# Altium project Farm_Pump.PrjPcb (part 1 of 2)
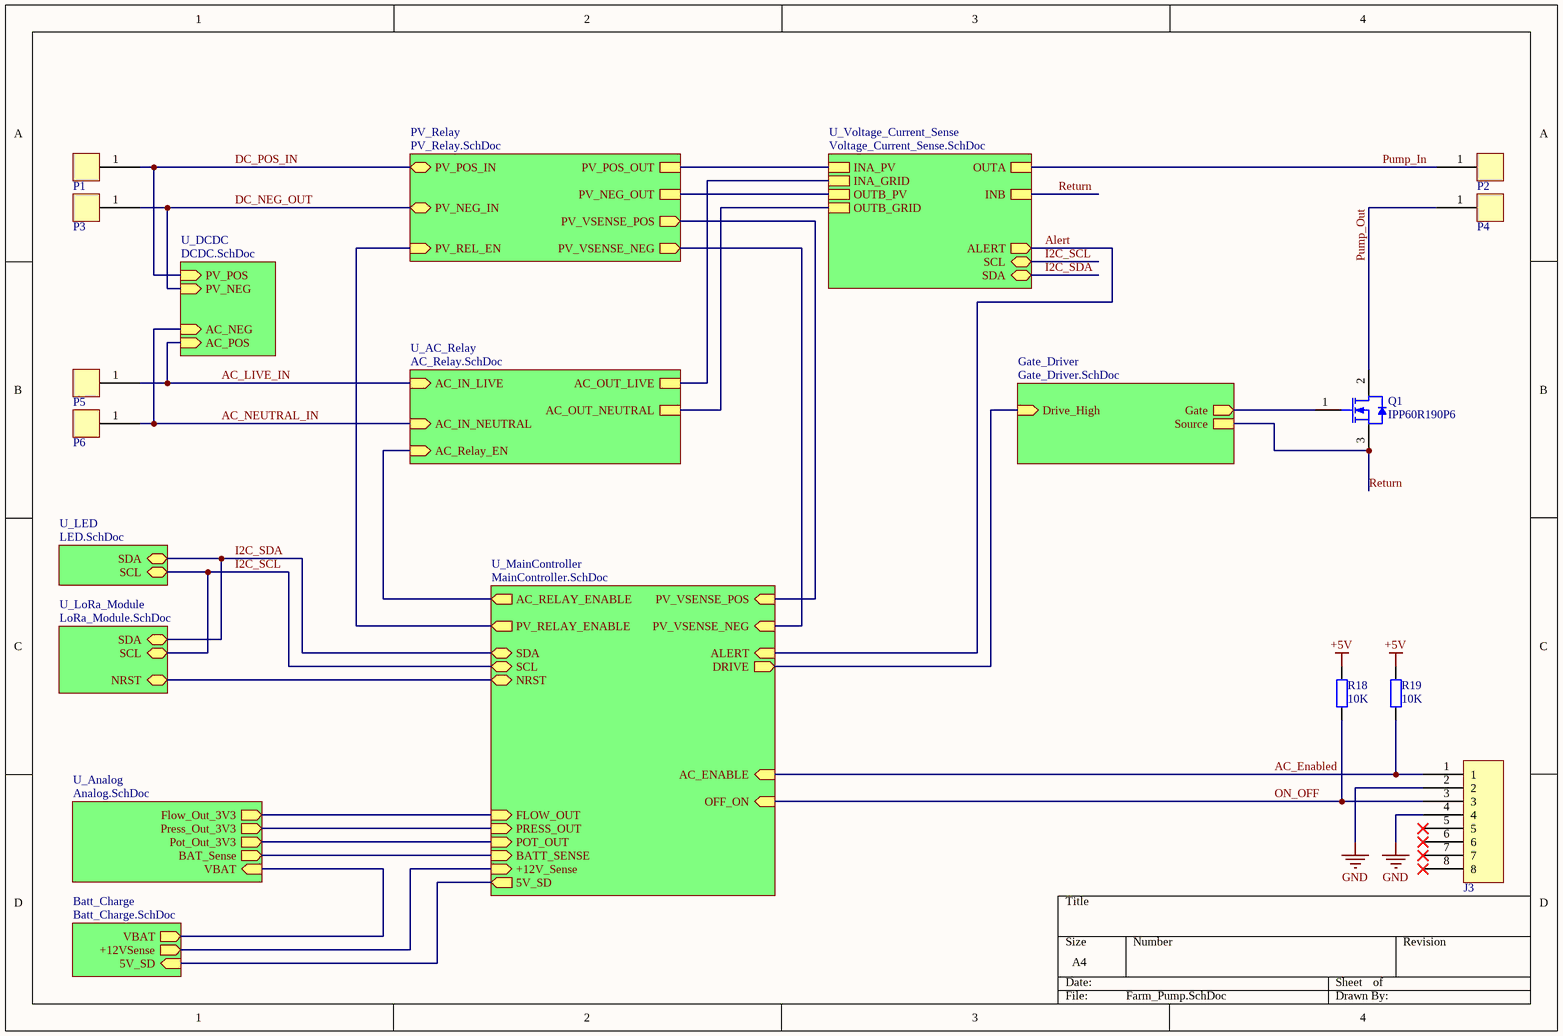
[diagram p0: Farm_Pump.SchDoc]
13 sheets, 148 parts. Net scope: hierarchical (ports join the sheet entries above them; power ports are global).
Board file: Farm_Pump.PcbDoc
Sheets:
  Farm_Pump.SchDoc
    Gate_Driver = Gate_Driver.SchDoc
    PV_Relay = PV_Relay.SchDoc
      PV Voltage Sense = DC_Volt_Sense.SchDoc
    Batt_Charge = Batt_Charge.SchDoc
    U_AC_Relay = AC_Relay.SchDoc
    U_Analog = Analog.SchDoc
    U_Voltage_Current_Sense = Voltage_Current_Sense.SchDoc
    U_DCDC = DCDC.SchDoc
    U_LED = LED.SchDoc
    U_LoRa_Module = LoRa_Module.SchDoc
    U_MainController = MainController.SchDoc
      U_STM32F038G6U6 = STM32F038G6U6.SchDoc

## Sheet Farm_Pump.SchDoc
size A4; SheetNumber: 1; SheetTotal: 13

### Parts
J3  MTJ-885X1  [MTJ-885X1]  (value not drawn)
P1  1719189  [1719189]  (value not drawn)
P2  1719189  [1719189]  (value not drawn)
P3  1719189  [1719189]  (value not drawn)
P4  1719189  [1719189]  (value not drawn)
P5  1719189  [1719189]  (value not drawn)
P6  1719189  [1719189]  (value not drawn)
Q1  IPP60R190P6  [INF-PG-TO220-3-1_A_V]
R18  10K  [RES 0603/1608]
R19  10K  [RES 0603/1608]

### Sub-sheets
Batt_Charge = Batt_Charge.SchDoc: VBAT (out), 5V_SD (in), +12VSense (out)
Gate_Driver = Gate_Driver.SchDoc: Drive_High (in), Gate (out), Source
PV_Relay = PV_Relay.SchDoc: PV_POS_IN (bidir), PV_NEG_IN (bidir), PV_VSENSE_POS (out), PV_POS_OUT, PV_VSENSE_NEG (out), PV_REL_EN (in), PV_NEG_OUT
U_AC_Relay = AC_Relay.SchDoc: AC_IN_LIVE (in), AC_IN_NEUTRAL (in), AC_Relay_EN (in), AC_OUT_LIVE, AC_OUT_NEUTRAL
U_Analog = Analog.SchDoc: Flow_Out_3V3 (out), Press_Out_3V3 (out), Pot_Out_3V3 (out), VBAT (in), BAT_Sense (out)
U_DCDC = DCDC.SchDoc: AC_POS (in), AC_NEG (in), PV_POS (in), PV_NEG (in)
U_LED = LED.SchDoc: SCL (bidir), SDA (bidir)
U_LoRa_Module = LoRa_Module.SchDoc: SCL (bidir), SDA (bidir), NRST (bidir)
U_MainController = MainController.SchDoc: PV_VSENSE_POS (in), PV_VSENSE_NEG (in), PV_RELAY_ENABLE (out), AC_RELAY_ENABLE (out), DRIVE (out), OFF_ON (in), AC_ENABLE (in), FLOW_OUT (in), PRESS_OUT (in), POT_OUT (in), BATT_SENSE (in), SCL (bidir), ALERT (in), SDA (bidir), 5V_SD (out), NRST (bidir), +12V_Sense (in)
U_Voltage_Current_Sense = Voltage_Current_Sense.SchDoc: INA_PV, OUTA, INB, OUTB_PV, ALERT (out), SCL (bidir), SDA (bidir), OUTB_GRID, INA_GRID

### Nets
+5V: R18.2 R19.2
DC_NEG_OUT: P3.1 ; sheet PV_Relay/PV_NEG_IN, sheet U_DCDC/PV_NEG
GND: J3.2 J3.4
ISOGND: sheet PV_Relay/PV_NEG_OUT, sheet U_AC_Relay/AC_OUT_NEUTRAL, sheet U_Voltage_Current_Sense/OUTB_PV, sheet U_Voltage_Current_Sense/OUTB_GRID
AC_Enabled: J3.1 R19.1 ; sheet U_MainController/AC_ENABLE
AC_LIVE_IN: P5.1 ; sheet U_AC_Relay/AC_IN_LIVE, sheet U_DCDC/AC_POS
AC_NEUTRAL_IN: P6.1 ; sheet U_AC_Relay/AC_IN_NEUTRAL, sheet U_DCDC/AC_NEG
Alert: sheet U_Voltage_Current_Sense/ALERT, sheet U_MainController/ALERT
DC_POS_IN: P1.1 ; sheet PV_Relay/PV_POS_IN, sheet U_DCDC/PV_POS
HV_SENSE_NEG: sheet PV_Relay/PV_VSENSE_NEG, sheet U_MainController/PV_VSENSE_NEG
HV_SENSE_POS: sheet PV_Relay/PV_VSENSE_POS, sheet U_MainController/PV_VSENSE_POS
I2C_SCL: sheet U_Voltage_Current_Sense/SCL, sheet U_LED/SCL, sheet U_LoRa_Module/SCL, sheet U_MainController/SCL
I2C_SDA: sheet U_Voltage_Current_Sense/SDA, sheet U_LED/SDA, sheet U_LoRa_Module/SDA, sheet U_MainController/SDA
NRST: sheet U_LoRa_Module/NRST, sheet U_MainController/NRST
ON_OFF: J3.3 R18.1 ; sheet U_MainController/OFF_ON
Pump_In: P2.1 ; sheet PV_Relay/PV_POS_OUT, sheet U_AC_Relay/AC_OUT_LIVE, sheet U_Voltage_Current_Sense/INA_PV, sheet U_Voltage_Current_Sense/OUTA, sheet U_Voltage_Current_Sense/INA_GRID
Pump_Out: P4.1 Q1.2(DRAIN)
Return: Q1.3(SOURCE) ; sheet Gate_Driver/Source, sheet U_Voltage_Current_Sense/INB
VBAT: sheet Batt_Charge/VBAT, sheet U_Analog/VBAT
NetD6_K: Q1.1(GATE) ; sheet Gate_Driver/Gate
NetR1_2: sheet U_AC_Relay/AC_Relay_EN, sheet U_MainController/AC_RELAY_ENABLE
NetR2_1: sheet U_Analog/Flow_Out_3V3, sheet U_MainController/FLOW_OUT
NetR4_1: sheet U_Analog/Press_Out_3V3, sheet U_MainController/PRESS_OUT
NetR6_2: sheet U_Analog/Pot_Out_3V3, sheet U_MainController/POT_OUT
NetR7_1: sheet U_Analog/BAT_Sense, sheet U_MainController/BATT_SENSE
NetR20_1: sheet Gate_Driver/Drive_High, sheet U_MainController/DRIVE
NetR24_2: sheet PV_Relay/PV_REL_EN, sheet U_MainController/PV_RELAY_ENABLE
NetR?#1_1: sheet Batt_Charge/+12VSense, sheet U_MainController/+12V_Sense
NetU3_7: sheet Batt_Charge/5V_SD, sheet U_MainController/5V_SD

Not connected (* = marked no-connect by the designer): J3 5* 6* 7* 8*

### Library data of the parts
J3 = MTJ-885X1: manufacturer: MODULAR JACK RJ45 8P8C; inventory_price: 0.97; partnumber: MTJ-885X1; Manufacturer Part Number: MTJ-885X1; URL Datasheet: https://app.adam-tech.com/products/download/data_sheet/203809/mtj-885x1-data-sheet.pdf; Digikey PN: 2057-MTJ-885X1-ND; parttype: Modular Connectors - Jacks
P1-P6 = 1719189: manufacturer: Phoenix Contact; Current: 41; Voltage: 1000; inventory_price: 3.143; partnumber: 1719189; Manufacturer Part Number: 1719189; URL Datasheet: https://docs.rs-online.com/3ee6/0900766b813ab54c.pdf; parttype: PCB Terminal Blocks
Q1 = CMP-1164-00090-1: N-Channel CoolMOS(TM) P6 Power Transistor, 600 V VDS, -55 to 150 degC, PG-TO220-3, Tube, Green; Manufacturer: Infineon; RDS (on) (max): 190 mOhm; VDS (max): 600 V; Green: TRUE; Polarity: FALSE; Halogen-free: TRUE; Packing: Tube; Mounting Technology: Through Hole; ComponentLink1Description: Manufacturer URL; ComponentLink3URL: http://www.infineon.com/dgdl/IKP30N65H5_2_1.pdf?folderId=db3a3043156fd5730115f56849b61941&fileId=5546d461464245d30146a51a2ca36d28; DatasheetVersion: Rev. 2.1; ComponentLink3Description: Package Specification; ComponentLink2Description: Datasheet; PackageReference: PG-TO220-3-1_A; ComponentLink2URL: http://www.infineon.com/dgdl/DS_IPx60R190P6_2_1.pdf?folderId=db3a3043156fd5730115c736bcc70ff2&fileId=db3a30433f2e70c5013f37c80e24240f; PartNumber: IPP60R190P6; PackageVersion: Rev. 05, 08/2007; PackageDescription: 3-Pin Plastic (Green) Transistor Single Outline Package, 10.03 x 8.98 mm Body, 2.54 mm Pitch; ComponentLink1URL: http://www.infineon.com/
R18 R19 = RG1608P-103-B-T5: RES SMD 10K OHM 0.1% 1/10W 0603; Manufacturer: Susumu; Package Imperial: 0603; Package Metric: 1608; Part Number: RG1608P-103-B-T5; Value: 10K; Tolerance: 0.1%; Digi-Key Part Number: RG16P10.0KBCT-ND

## Sheet Gate_Driver.SchDoc
size A4; SheetNumber: 6; SheetTotal: 13
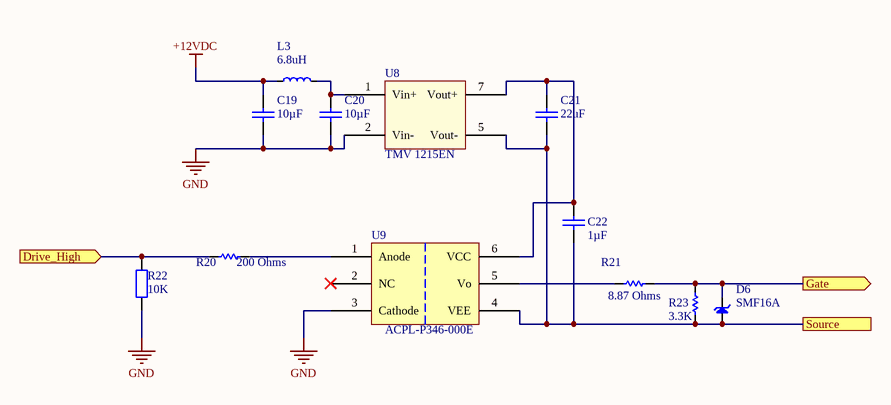
[diagram p1: Gate_Driver.SchDoc]

### Parts
C19  10µF  [0603C]
C20  10µF  [0603C]
C21  22uF  [0805c]
C22  1µF  [0603C]
D6  SMF16A  [SOD-123H]
L3  6.8uH  [1206R]
R20  200 Ohms  [0603R]
R21  8.87 Ohms  [0805R]
R22  10K  [RES 0603/1608]
R23  3.3K  [0603R]
U8  TMV 1215EN  [TMVXXXXEN]
U9  ACPL-P346-000E  [ACPL-P346-000E]

### Ports
Drive_High (in), Gate (out), Source

### Nets
+12VDC: C19.1 L3.1
GND: C19.2 C20.2 R22.1 U8.2(Vin-) U9.3(Cathode)
Return: C21.2 C22.2 D6.A R23.1 U8.5(Vout-) U9.4(VEE) ; port Source
NetC20_1: C20.1 L3.2 U8.1(Vin+)
NetC21_1: C21.1 C22.1 U8.7(Vout+) U9.6(VCC)
NetD6_K: D6.K R21.2 R23.2 ; port Gate
NetR20_1: R20.1 R22.2 ; port Drive_High
NetR20_2: R20.2 U9.1(Anode)
NetR21_1: R21.1 U9.5(Vo)

Not connected (* = marked no-connect by the designer): U9 2(NC)*

### Library data of the parts
C19 C20 = 1000-0107: CAP CER 10UF 16V X6S 0603; Manufacturer: Murata Electronics; Manufacturer Part Number: GRM188C81C106MA73D; id: 427111; inventory_price: 0.1975; x_Link_Description: Datasheet; x_max_temp: 105°C; x_min_temp: -55°C; x_Tolerance: ±20%; partnumber: 1000-0107; created_on: 9/04/2021 11:45:26 AM; parttype: Ceramic Capacitors; rohs: 1; updated_on: 24/08/2021 12:09:56 PM; x_Capacitance: 10µF; x_Link_URL: https://www.murata.com/-/media/webrenewal/support/library/catalog/products/capacitor/ceramiccapacitor/c02e.ashx?la=en-us&cvid=20210120024548000000; x_temp_coef: X6S; x_Vol: 16V
C21 = 1000-0047: CAP CER 2.2UF 25V X5R 0805; Manufacturer: Samsung Electro-Mechanics; Manufacturer Part Number: CL21A225KAFNNNG; id: 377963; inventory_price: 0.0384; x_Capacitance: 2.2µF; x_Link_Description: Datasheet; x_max_temp: 85°C; x_min_temp: -55°C; x_Tolerance: ±10%; partnumber: 1000-0047; created_on: 31/03/2020 1:35:31 PM; parttype: Ceramic Capacitors; rohs: 1; updated_on: 24/08/2021 12:09:55 PM; x_Link_URL: https://www.samsungsem.com/error500.html
C22 = 1000-0053: CAP CER 1UF 25V X7R 0603; Manufacturer: Samsung Electro-Mechanics; Manufacturer Part Number: CL10B105KA8NNNC; id: 402613; inventory_price: 0.1; x_current: Not Applicable; x_link_description: Datasheet; x_max_temp: 125°C; x_min_temp: -55°C; x_port_to_unleashed: No; x_Tolerance: ±10%; partnumber: 1000-0053; created_on: 5/08/2020 3:03:59 PM; parttype: Ceramic Capacitors; rohs: 1; updated_on: 3/02/2022 2:42:16 PM; x_Capacitance: 1 µF; x_inductance: Not Applicable; x_link_url: https://www.samsungsem.com/kr/support/product-search/mlcc/CL10B105KA8NNNC.jsp; x_power: Not Applicable; x_resistance: Not Applicable; x_temp_coef: X7R; x_vol: 25V
D6 = SMF16A: Zener Diode; manufacturer: Littelfuse Inc.; Maximun Temperature: 150; Minimum Temperature: -55; Voltage: 16V; inventory_price: 0.36; partnumber: SMF16A; Manufacturer Part Number: SMF16A; URL Datasheet: https://www.littelfuse.com/~/media/electronics/datasheets/tvs_diodes/littelfuse_tvs_diode_smf_datasheet.pdf.pdf; parttype: TVS - Diodes
L3 = 1002-0001: FIXED IND 6.8UH 380MA 170 MOHM; Manufacturer Part Number: LB3218T6R8M; manufacturer: Taiyo Yuden; id: 376135; inventory_price: 0.1447; x_current: pcbs@relectrify.com; x_Link_Description: Datasheet; x_Tolerance: ±20%; ComponentLink1Description: Datasheet; ComponentLink1URL: https://www.bourns.com/docs/Product-Datasheets/SRR1260.pdf; partnumber: 1002-0001; created_on: 4/03/2020 11:07:19 PM; parttype: Fixed Inductors; rohs: 1; updated_on: 10/08/2021 1:51:55 PM; x_Link_URL: https://ds.yuden.co.jp/TYCOMPAS/ut/detail?pn=LB3218T6R8M  &u=M
R20 = 1007-0188: RES 200 OHM 1% 1/8W 0603; Manufacturer: Stackpole Electronics Inc; Manufacturer Part Number: RNCP0603FTD200R; id: 474437; inventory_price: 0.1; x_Capacitance: Not Applicable; x_link_description: Datasheet; x_max_temp: 155°C; x_min_temp: -55°C; x_port_to_unleashed: No; x_power: 0.125W, 1/8W; x_temp_coef: ±100ppm/°C; partnumber: 1007-0188; created_on: 15/05/2022 12:28:10 PM; parttype: Chip Resistor - Surface Mount; rohs: 1; updated_on: 15/05/2022 12:28:19 PM; x_current: Not Applicable; x_inductance: Not Applicable; x_link_url: https://www.seielect.com/catalog/sei-rncp.pdf; x_resistance: 200 Ohms; x_Tolerance: ±1%; x_vol: Not Applicable
R21 = 1007-0189: RES 8.87 OHM 1% 1/8W 0805; Manufacturer: Stackpole Electronics Inc; Manufacturer Part Number: RMCF0805FT8R87; id: 474438; inventory_price: 0.1; x_Capacitance: Not Applicable; x_link_description: Datasheet; x_max_temp: 155°C; x_min_temp: -55°C; x_port_to_unleashed: No; x_power: 0.125W, 1/8W; x_temp_coef: ±200ppm/°C; partnumber: 1007-0189; created_on: 15/05/2022 12:44:33 PM; parttype: Chip Resistor - Surface Mount; rohs: 1; updated_on: 15/05/2022 12:44:42 PM; x_current: Not Applicable; x_inductance: Not Applicable; x_link_url: https://www.seielect.com/catalog/sei-rmcf_rmcp.pdf; x_resistance: 8.87 Ohms; x_Tolerance: ±1%; x_vol: Not Applicable
R22 = RC0603FR-0710KL: RES SMD 10K OHM 1% 1/10W 0603; Manufacturer: Yageo; Package Imperial: 0603; Package Metric: 1608; Temperature Coefficient: ±100ppm/°C; Power (Watts): 0.1W, 1/10W; Part Number: RC0603FR-0710KL; Value: 10K; Tolerance: ±1%; Digi-Key Part Number: 311-10.0KHRCT-ND
R23 = 1007-0148: RES SMD 3.3K OHM 1% 1/10W 0603; Manufacturer: Ralec Electronic Corporation; Manufacturer Part Number: RTT033301FTP; id: 437722; inventory_price: 0.00535; x_link_description: Datasheet; x_max_temp: 155°C; x_min_temp: -55°C; partnumber: 1007-0148; created_on: 2/09/2021 1:57:43 PM; parttype: Chip Resistor - Surface Mount; rohs: 1; updated_on: 2/09/2021 1:57:50 PM; x_link_url: https://www.yageo.com/upload/media/product/productsearch/datasheet/rchip/PYu-RC_Group_51_RoHS_L_11.pdf; x_power: 1/10W; x_Tolerance: ±1%
U8 = PDM-S: DC DC CONVERTER 15V 1W; Manufacturer: Traco Power; ComponentLink1Description: Datasheet; Mount: TH; Supplier 1: Digi-Key; ComponentLink1URL: https://www.tracopower.com/products/tmv-en.pdf; Manufacturer Part Number: TMV 1215EN
U9 = 1107-0007: OPTOISO 3.75KV 1CH GATE DRVR 6SO; manufacturer: Broadcom Limited; id: 474436; inventory_price: 5; x_Capacitance: Not Applicable; x_link_description: Datasheet; x_max_temp: 105°C; x_min_temp: -40°C; x_port_to_unleashed: No; partnumber: 1107-0007; Manufacturer Part Number: ACPL-P346-000E; created_on: 15/05/2022 12:12:55 PM; parttype: Isolators - Gate Drivers; rohs: 1; updated_on: 15/05/2022 12:13:04 PM; x_current: Not Applicable; x_inductance: Not Applicable; x_link_url: https://docs.broadcom.com/docs/AV02-4078EN; x_power: Not Applicable; x_resistance: Not Applicable; x_temp_coef: Not Applicable; x_Tolerance: Not Applicable; x_vol: Not Applicable

## Sheet PV_Relay.SchDoc
size A4; SheetNumber: 8; SheetTotal: 13
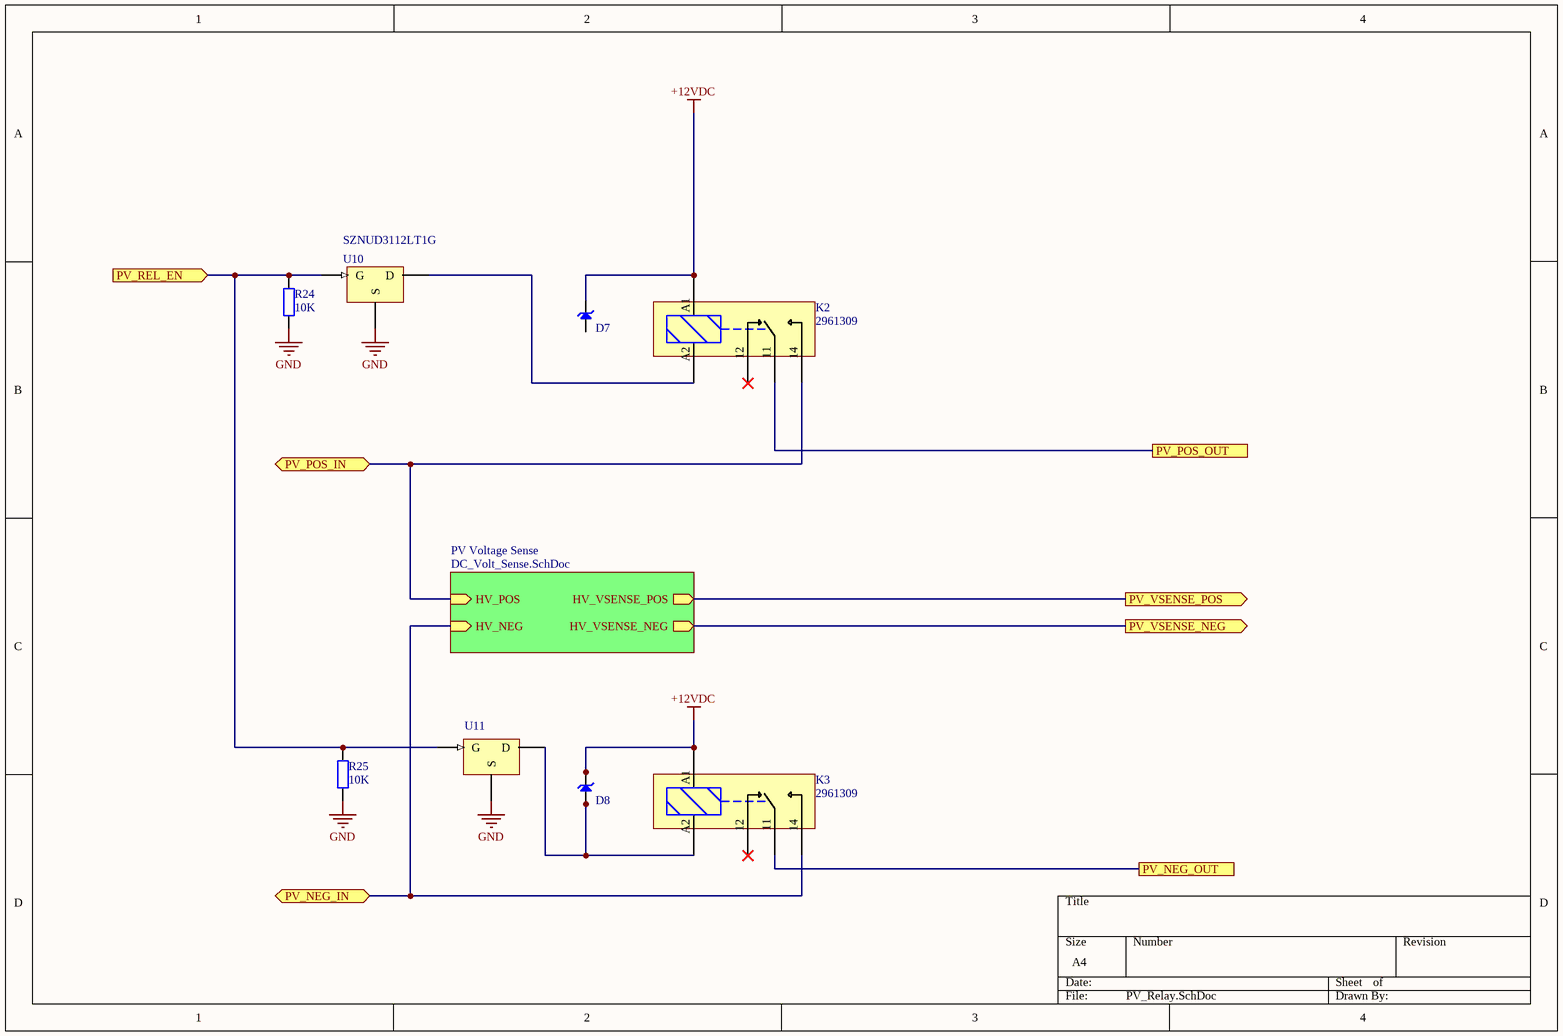
[diagram p2: PV_Relay.SchDoc]

### Parts
D7  SMF16A  [SOD-123H]  (value not drawn)
D8  SMF16A  [SOD-123H]  (value not drawn)
K2  2961309  [2961309]
K3  2961309  [2961309]
R24  10K  [RES 0603/1608]
R25  10K  [RES 0603/1608]
U10  SZNUD3112LT1G  [SZNUD3112LT1G]
U11  SZNUD3112LT1G  [SZNUD3112LT1G]  (value not drawn)

### Sub-sheets
PV Voltage Sense = DC_Volt_Sense.SchDoc: HV_VSENSE_NEG (out), HV_POS (in), HV_VSENSE_POS (out), HV_NEG (in)

### Ports
PV_NEG_IN (bidir), PV_NEG_OUT, PV_POS_IN (bidir), PV_POS_OUT, PV_REL_EN (in), PV_VSENSE_NEG (out), PV_VSENSE_POS (out)

### Nets
+12VDC: D7.K D8.K K2.A1 K3.A1
DC_NEG_OUT: K3.14 ; port PV_NEG_IN, sheet PV Voltage Sense/HV_NEG
GND: R24.1 R25.1 U10.2(S) U11.2(S)
ISOGND: K3.11 ; port PV_NEG_OUT
DC_POS_IN: K2.14 ; port PV_POS_IN, sheet PV Voltage Sense/HV_POS
HV_SENSE_NEG: port PV_VSENSE_NEG, sheet PV Voltage Sense/HV_VSENSE_NEG
HV_SENSE_POS: port PV_VSENSE_POS, sheet PV Voltage Sense/HV_VSENSE_POS
Pump_In: K2.11 ; port PV_POS_OUT
NetD8_A: D8.A K3.A2 U11.3(D)
NetK2_A2: K2.A2 U10.3(D)
NetR24_2: R24.2 R25.2 U10.1(G) U11.1(G) ; port PV_REL_EN

Not connected (* = marked no-connect by the designer): D7 A; K2 12(16)*; K3 12(16)*

### Library data of the parts
D7 D8 = SMF16A: as D6 on sheet Gate_Driver; partnumber: SMF16A; Manufacturer Part Number: SMF16A; URL Datasheet: https://www.littelfuse.com/~/media/electronics/datasheets/tvs_diodes/littelfuse_tvs_diode_smf_datasheet.pdf.pdf; parttype: TVS - Diodes
K2 K3 = 2961309: Plug-in miniature power relay, with power contact for high continuous currents, 1 changeover contact, input voltage 12 V DC
R24 R25 = RC0603FR-0710KL: as R22 on sheet Gate_Driver; Part Number: RC0603FR-0710KL; Value: 10K; Tolerance: ±1%; Digi-Key Part Number: 311-10.0KHRCT-ND
U10 U11 = SZNUD3112LT1GOSCT-ND: manufacturer: ON Semiconductor; inventory_price: 0.93; partnumber: SZNUD3112LT1GOSCT-ND; Manufacturer Part Number: SZNUD3112LT1GOSCT-ND; URL Datasheet: https://www.onsemi.com/pdf/datasheet/nud3112-d.pdf; parttype: PMIC - Power Distribution Switches, Load Drivers

## Sheet DC_Volt_Sense.SchDoc
size A4; SheetNumber: 9; SheetTotal: 13
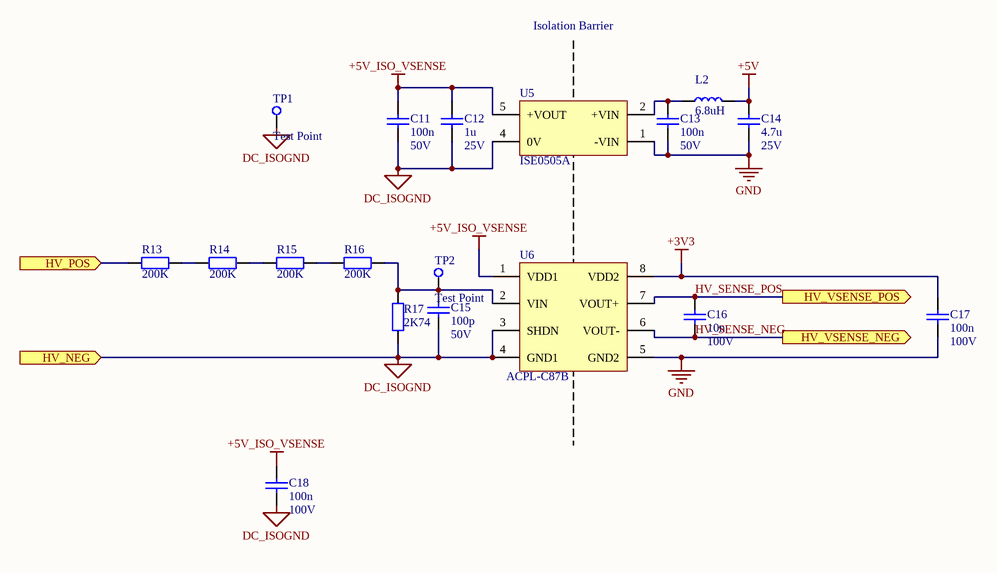
[diagram p3: DC_Volt_Sense.SchDoc]

### Parts
C11  100n  Voltage - Rated: 50V  [CAP 0603/1608]
C12  1u  Voltage - Rated: 25V  [CAP 0603/1608]
C13  100n  Voltage - Rated: 50V  [CAP 0603/1608]
C14  4.7u  Voltage - Rated: 25V  [CAP 0603/1608]
C15  100p  Voltage - Rated: 50V  [CAP 0603/1608]
C16  10n  Voltage - Rated: 100V  [CAP 0603/1608]
C17  100n  Voltage - Rated: 100V  [CAP 0805/2012 - 1.4MM]
C18  100n  Voltage - Rated: 100V  [CAP 0805/2012 - 1.4MM]
L2  6.8uH  [1210L]
R13  200K  [RES 1206/3216]
R14  200K  [RES 1206/3216]
R15  200K  [RES 1206/3216]
R16  200K  [RES 1206/3216]
R17  2K74  [RES 1206/3216]
TP1  Test Point  [RCT-0C]
TP2  Test Point  [RCT-0C]
U5  ISE0505A  [XP ISE 8-SMD]
U6  ACPL-C87B  [Broadcom SSO-8]

### Ports
HV_NEG (in), HV_POS (in), HV_VSENSE_NEG (out), HV_VSENSE_POS (out)

### Nets
+3V3: C17.2 U6.8(VDD2)  [project net VDD]
+5V: C14.2 L2.1
+5V_ISO_VSENSE: C11.2 C12.2 C18.2 U5.5(+VOUT) U6.1(VDD1)
DC_ISOGND: C11.1 C12.1 C15.1 C18.1 R17.1 TP1.1(TP) U5.4(0V) U6.3(SHDN) U6.4(GND1) ; port HV_NEG  [project net DC_NEG_OUT]
GND: C13.2 C14.1 C17.1 U5.1(-VIN) U6.5(GND2)
DC_POS_IN: R13.1 ; port HV_POS
HV_SENSE_NEG: C16.1 U6.6(VOUT-) ; port HV_VSENSE_NEG
HV_SENSE_POS: C16.2 U6.7(VOUT+) ; port HV_VSENSE_POS
NetC13_1: C13.1 L2.2 U5.2(+VIN)
NetC15_2: C15.2 R16.2 R17.2 TP2.1(TP) U6.2(VIN)
NetR13_2: R13.2 R14.1
NetR14_2: R14.2 R15.1
NetR15_2: R15.2 R16.1

### Notes on the sheet
- Isolation Barrier

### Library data of the parts
C11 C13 = GCM188R71H104KA57D: CAP CER 0.1UF 50V X7R 0603; Manufacturer: Murata Electronics North America; Package Imperial: 0603; Package Metric: 1608; Value: 100n; Part Number: GCM188R71H104KA57D; Digi-Key Part Number: 490-4779-1-ND
C12 = CL10B105KA8NNNC: CAP CER 1UF 25V X7R 0603; Manufacturer: Samsung Electro-Mechanics; Package Imperial: 0603; Package Metric: 1608; Tolerance: 0.1; Value: 1u; Part Number: CL10B105KA8NNNC; Dielectric: X7R; Digi-Key Part Number: 1276-1184-1-ND
C14 = GRM188C81E475KE11D: CAP CER 4.7UF 25V X6S 0603; Manufacturer: Murata Electronics North America; Package Imperial: 0603; Package Metric: 1608; Tolerance: 0.1; Value: 4.7u; Part Number: GRM188C81E475KE11D; Dielectric: X6S; Digi-Key Part Number: 490-7199-1-ND
C15 = C0603C101J5GACTU: CAP CER 100PF 50V C0G/NP0 0603; Manufacturer: KEMET; Package Imperial: 0603; Package Metric: 1608; Tolerance: 0.05; Value: 100p; Part Number: C0603C101J5GACTU; Dielectric: C0G/NP0; Digi-Key Part Number: 399-1061-1-ND
C16 = GCM188R72A103KA37D: CAP CER 10000PF 100V X7R 0603; Manufacturer: Murata Electronics North America; Package Imperial: 0603; Package Metric: 1608; Value: 10n; Part Number: GCM188R72A103KA37D; Digi-Key Part Number: 490-4781-1-ND
C17 C18 = GCM21BR72A104KA37L: CAP CER 0.1UF 100V X7R 0805; Manufacturer: Murata Electronics North America; Package Imperial: 0805; Package Metric: 2012; Tolerance: 0.1; Value: 100n; Part Number: GCM21BR72A104KA37L; Dielectric: X7R; Digi-Key Part Number: 490-4789-1-ND
L2 = TFM322512ALMA6R8MTAA: Part Number: MLZ2012N6R8LTD25; Manufacturer: TDK Corporation; Maximun Temperature: 150; Minimum Temperature: -55; inventory_price: 1.44; Digi-Key Part Number: 445-16384-1-ND; partnumber: TFM322512ALMA6R8MTAA; Manufacturer Part Number: TDK Corporation; URL Datasheet: https://product.tdk.com/info/en/catalog/datasheets/inductor_automotive_power_tfm322512alma_en.pdf?ref_disty=digikey; Digikey PN: 445-TFM322512ALMA6R8MTAACT-ND; parttype: Fixed Inductor
R13-R16 = RC1206FR-07200KL: RES SMD 200K OHM 1% 1/4W 1206; Manufacturer: Yageo; Package Imperial: 1206; Package Metric: 3216; Temperature Coefficient: ±100ppm/°C; Power (Watts): 0.25W, 1/4W; Part Number: RC1206FR-07200KL; Value: 200K; Tolerance: ±1%; Digi-Key Part Number: 311-200KFRCT-ND
R17 = RC1206FR-072K74L: RES SMD 2.74K OHM 1% 1/4W 1206; Manufacturer: Yageo; Package Imperial: 1206; Package Metric: 3216; Temperature Coefficient: ±100ppm/°C; Power (Watts): 0.25W, 1/4W; Part Number: RC1206FR-072K74L; Value: 2K74; Tolerance: ±1%; Digi-Key Part Number: 311-2.74KFRCT-ND
TP1 TP2 = RCT-0C: 0805 PROBE PAD; Part Number: RCT-0C; Digi-Key Part Number: A106144CT-ND
U5 = ISE0505A: Isolated Module DC DC Converter 1 Output 5V 200mA 4.5V - 5.5V Input; Manufacturer: XP Power; Part Number: ISE0505A; Digi-Key Part Number: 1470-2945-1-ND
U6 = ACPL-C87B: Isolation Amplifier 1 Circuit Differential 8-SO; Manufacturer: Broadcom; Part Number: ACPL-C87B; Manufacturer Part Number: ACPL-C87B; Digi-Key Part Number: 516-2579-5-ND

## Sheet Batt_Charge.SchDoc
size A4; SheetNumber: 4; SheetTotal: 13
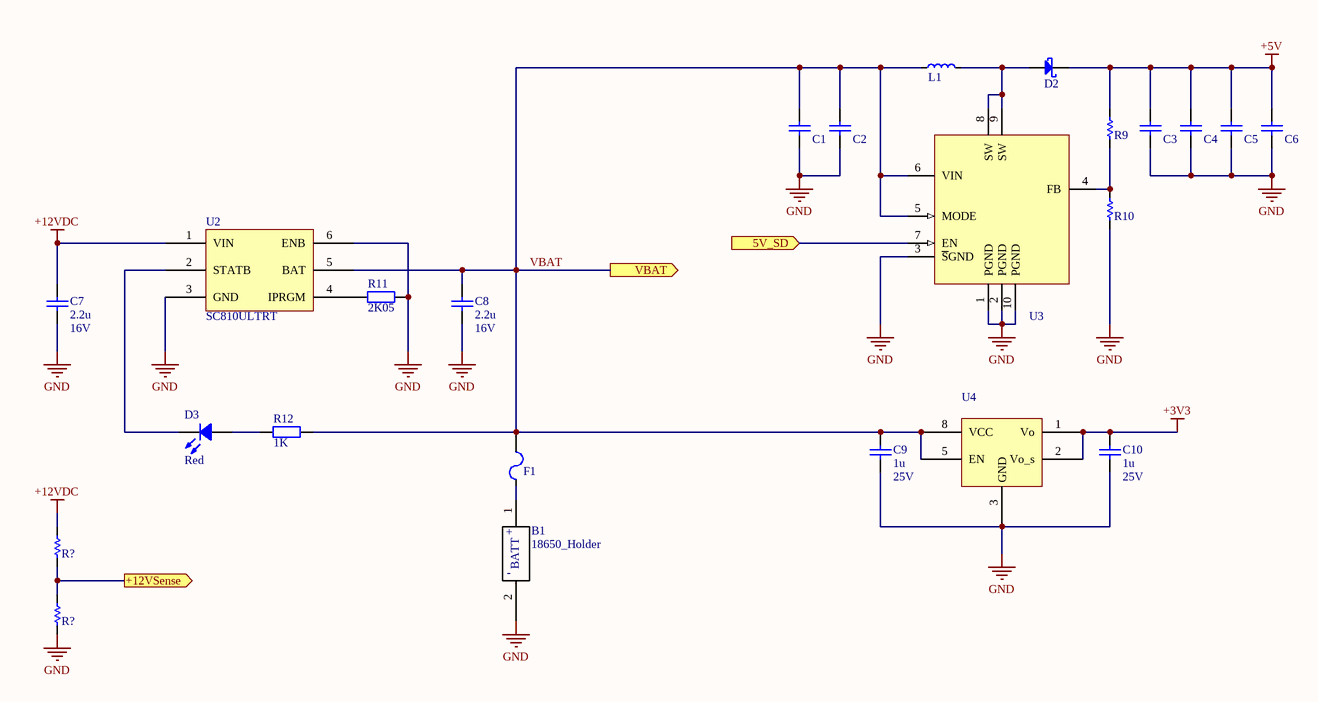
[diagram p4: Batt_Charge.SchDoc]

### Parts
(Parts that share a designator on the sheet are numbered #1, #2 ... from top to bottom, then left to right.)
B1  18650_Holder  [1042]
C1  10µF  [1206C]  (value not drawn)
C2  10µF  [1206C]  (value not drawn)
C3  10µF  [1206C]  (value not drawn)
C4  10µF  [1206C]  (value not drawn)
C5  10µF  [1206C]  (value not drawn)
C6  10µF  [1206C]  (value not drawn)
C7  2.2u  Voltage - Rated: 16V  [CAP 0805/2012 - 1.4MM]
C8  2.2u  Voltage - Rated: 16V  [CAP 0805/2012 - 1.4MM]
C9  1u  Voltage - Rated: 25V  [CAP 0805/2012 - 1.4MM]
C10  1u  Voltage - Rated: 25V  [CAP 0805/2012 - 1.4MM]
D2  PMEG3020ER,115  [SOD123]  (value not drawn)
D3  Red  [LED 0603/1608 RED]
F1  TR/3216TD10-R  [1206]  (value not drawn)
L1  10 µH  [INDC2520X100N]  (value not drawn)
R9  63.4 kOhms  [0603R]  (value not drawn)
R10  SMT  [0603R]  (value not drawn)
R11  2K05  [RES 0603/1608]
R12  1K  [RES 0603/1608]
R?#1  100 kOhms  [0603R]  (value not drawn)
R?#2  27 kOhms  [0603R]  (value not drawn)
U2  SC810ULTRT  [SC810ULTRT]
U3  MCP1665T-E/MRA  [MCP1665T-EMRA]  (value not drawn)
U4  BD33HC0WEFJ-E2  [BD33HC0WEFJ]  (value not drawn)

### Ports
5V_SD (in), +12VSense (out), VBAT (out)

### Nets
+3V3: C10.2 U4.1(Vo) U4.2(Vo_s)  [project net VDD]
+5V: C3.1 C4.1 C5.1 C6.1 D2.1(K) R9.2
+12VDC: C7.2 R?#1.2 U2.1(VIN)
GND: B1.2(NEG) C1.2 C2.2 C3.2 C4.2 C5.2 C6.2 C7.1 C8.1 C9.1 C10.1 R10.1 R11.2 R?#2.1 U2.3(GND) U2.6(ENB) U3.1(PGND) U3.2(PGND) U3.3(~{S}GND) U3.10(PGND) U4.3(GND)
VBAT: C1.1 C2.1 C8.2 C9.2 F1.2 L1.1 R12.2 U2.5(BAT) U3.5(MODE) U3.6(VIN) U4.5(EN) U4.8(VCC) ; port VBAT
NetB1_1: B1.1(POS) F1.1
NetD2_2: D2.2(A) L1.2 U3.8(SW) U3.9(SW)
NetD3_1: D3.1 R12.1
NetD3_2: D3.2 U2.2(STATB)
NetR9_1: R9.1 R10.2 U3.4(FB)
NetR11_1: R11.1 U2.4(IPRGM)
NetR?#1_1: R?#1.1 R?#2.2 ; port +12VSense
NetU3_7: U3.7(EN) ; port 5V_SD

### Notes on the sheet
- (in symbol 1042) +; BATT; -

### Library data of the parts
B1 = 1042: 18650 Cell and Holder 3-4.2V
C1-C6 = 1000-0124: CAP CER 10UF 16V X7R 1206; Manufacturer: Walsin Technology Corporation; Manufacturer Part Number: 1206B106K160CT; id: 442554; inventory_price: 1; x_Link_Description: Datasheet; x_max_temp: 125°C; x_min_temp: -55°C; x_Tolerance: ±10%; partnumber: 1000-0124; created_on: 26/10/2021 11:23:13 AM; parttype: Ceramic Capacitors; rohs: 1; updated_on: 26/10/2021 11:23:26 AM; x_Capacitance: 10µF; x_Link_URL: http://www.passivecomponent.com/wp-content/uploads/2018/10/MLCC.pdf; x_temp_coef: X7R; x_Vol: 16V
C7 C8 = EMK212B7225KG-T: CAP CER 2.2UF 16V X7R 0805; Manufacturer: Taiyo Yuden; Package Imperial: 0805; Package Metric: 2012; Tolerance: 0.1; Value: 2.2u; Part Number: EMK212B7225KG-T; Dielectric: X7R; Digi-Key Part Number: 587-1431-1-ND
C9 C10 = TMK212B7105KG-T: CAP CER 1UF 25V X7R 0805; Manufacturer: Taiyo Yuden; Package Imperial: 0805; Package Metric: 2012; Tolerance: 0.1; Value: 1u; Part Number: TMK212B7105KG-T; Dielectric: X7R; Digi-Key Part Number: 587-1281-1-ND
D2 = 1047-0008: DIODE SCHOTTKY 30V 2A SOD123W; Manufacturer: Nexperia USA Inc.; Current: A; Voltage: V; id: 429535; inventory_price: 0.2867; x_Link_Description: Datasheet; Supplier 1: Digi-Key; Supplier Part Number 1: CUS10S30H3FTR-ND; Manufacturer Part Number: PMEG3020ER,115; Mount: SMT; ComponentLink1URL: https://toshiba.semicon-storage.com/info/docget.jsp?did=14077&prodName=CUS10S30; ComponentLink1Description: Datasheet; partnumber: 1047-0008; created_on: 19/05/2021 12:32:57 PM; parttype: Diodes - Rectifiers - Single; rohs: 1; updated_on: 18/10/2021 4:50:09 PM; x_Link_URL: https://assets.nexperia.com/documents/data-sheet/PMEG3020ER.pdf
D3 = LTST-C190KRKT: Red 631nm LED Indication - Discrete 2V 0603 (1608 Metric); Manufacturer: Lite-On Inc.; Part Number: LTST-C190KRKT; Value: Red; Digi-Key Part Number: 160-1436-1-ND
F1 = TR/3216TD10-R: fuse holder; Manufacturer Part Number: Eaton - Electronics Division; Current: 10A; inventory_price: 1.95; partnumber: TR/3216TD10-R; URL Datasheet: https://www.eaton.com/content/dam/eaton/products/electronic-components/resources/data-sheet/eaton-3216td-time-delay-chip-surface-mount-fuse-data-sheet.pdf; Digikey PN: TR/3216TD10-R; manufacturer: Eaton - Electronics Division; parttype: Fuses
L1 = 1002-0031: FIXED IND 10UH 750MA 650MOHM SMD; Manufacturer Part Number: MAKK2520H100M; manufacturer: Taiyo Yuden; id: 462234; inventory_price: 0.28; x_Capacitance: Not Applicable; x_Link_Description: Datasheet; x_max_temp: 105°C; x_min_temp: -40°C; x_port_to_unleashed: No; x_Tolerance: ±20%; ComponentLink1Description: Datasheet; ComponentLink1URL: https://www.bourns.com/docs/Product-Datasheets/SRR1260.pdf; partnumber: 1002-0031; created_on: 3/04/2022 8:17:03 AM; parttype: Fixed Inductors; rohs: 1; updated_on: 6/04/2022 9:21:30 PM; x_current: 750 mA; x_inductance: 10 µH; x_Link_URL: https://ds.yuden.co.jp/TYCOMPAS/ut/detail?pn=MAKK2520H100M &u=M; x_Power: Not Applicable; x_resistance: Not Applicable; x_temp_coef: Not Applicable; x_Vol: Not Applicable
R9 = 1007-0174: RES 63.4K OHM 1% 1/10W 0603; Manufacturer: Stackpole Electronics Inc; Manufacturer Part Number: RMCF0603FT63K4; id: 462399; inventory_price: 0.1; x_Capacitance: Not Applicable; x_Link_Description: Datasheet; x_max_temp: 155°C; x_min_temp: -55°C; x_port_to_unleashed: No; x_Power: 0.1W, 1/10W; x_temp_coef: ±100ppm/°C; partnumber: 1007-0174; created_on: 6/04/2022 9:39:45 PM; parttype: Chip Resistor - Surface Mount; rohs: 1; updated_on: 6/04/2022 9:40:00 PM; x_current: Not Applicable; x_inductance: Not Applicable; x_Link_URL: https://www.seielect.com/catalog/sei-rmcf_rmcp.pdf; x_resistance: 63.4 kOhms; x_Tolerance: ±1%; x_Vol: Not Applicable
R10 = 1007-0018: RES 20K OHM 1% 1/8W 0603; Manufacturer: Stackpole Electronics Inc; Manufacturer Part Number: RNCP0603FTD20K0; id: 377086; inventory_price: 0.1; x_Capacitance: Not Applicable; x_Link_Description: Datasheet; x_max_temp: 155°C; x_min_temp: -55°C; x_port_to_unleashed: No; x_Power: 0.125W, 1/8W; x_resistance: 20 kOhms; x_temp_coef: ±100ppm/°C; partnumber: 1007-0018; created_on: 17/03/2020 11:40:16 AM; parttype: Chip Resistor - Surface Mount; rohs: 1; updated_on: 8/04/2022 11:10:51 AM; x_current: Not Applicable; x_inductance: Not Applicable; x_Link_URL: https://www.seielect.com/catalog/sei-rncp.pdf; x_Tolerance: ±1%; x_Vol: Not Applicable
R11 = RC0603FR-072K05L: RES SMD 2.05K OHM 1% 1/10W 0603; Manufacturer: Yageo; Package Imperial: 0603; Package Metric: 1608; Temperature Coefficient: ±100ppm/°C; Power (Watts): 0.1W, 1/10W; Part Number: RC0603FR-072K05L; Value: 2K05; Tolerance: ±1%; Digi-Key Part Number: 311-2.05KHRCT-ND
R12 = RC0603FR-071KL: RES SMD 1K OHM 1% 1/10W 0603; Manufacturer: Yageo; Package Imperial: 0603; Package Metric: 1608; Temperature Coefficient: ±100ppm/°C; Power (Watts): 0.1W, 1/10W; Part Number: RC0603FR-071KL; Value: 1K; Tolerance: ±1%; Digi-Key Part Number: 311-1.00KHRCT-ND
R?#1 = 1007-0133: RES 100K OHM 1% 1/10W 0603; Manufacturer: Walsin Technology Corporation; Manufacturer Part Number: WR06X1003FTL; id: 436176; inventory_price: 0.0022; x_link_description: Datasheet; x_max_temp: 155°C; x_min_temp: -55°C; partnumber: 1007-0133; created_on: 10/08/2021 12:08:36 PM; parttype: Chip Resistor - Surface Mount; rohs: 1; updated_on: 10/08/2021 12:25:24 PM; x_link_url: http://www.passivecomponent.com/wp-content/uploads/chipR/ASC_WR.pdf; x_power: 1/10W; x_Tolerance: ±1%
R?#2 = 1007-0190: RES 27K OHM 1% 1/10W 0603; Manufacturer: TE Connectivity Passive Product; Manufacturer Part Number: CRGCQ0603F27K; id: 474439; inventory_price: 0.1; x_Capacitance: Not Applicable; x_link_description: Datasheet; x_max_temp: 155°C; x_min_temp: -55°C; x_port_to_unleashed: No; x_power: 0.1W, 1/10W; x_temp_coef: ±100ppm/°C; partnumber: 1007-0190; created_on: 15/05/2022 1:25:00 PM; parttype: Chip Resistor - Surface Mount; rohs: 1; updated_on: 15/05/2022 1:25:09 PM; x_current: Not Applicable; x_inductance: Not Applicable; x_link_url: https://www.te.com/commerce/DocumentDelivery/DDEController?Action=srchrtrv&DocNm=1773204-3&DocType=DS&DocLang=English; x_resistance: 27 kOhms; x_Tolerance: ±1%; x_vol: Not Applicable
U2 = SC810ULTRT: IC BATT CHG LI-ION 1CELL 6MLP
U3 = 1028-0017: IC REG BOOST ADJ 1A 10VQFN; manufacturer: Microchip Technology; id: 461088; inventory_price: 1.87; x_Capacitance: Not Applicable; x_Link_Description: Datasheet; x_max_temp: 125°C (TA); x_min_temp: -40°C; x_port_to_unleashed: No; partnumber: 1028-0017; Manufacturer Part Number: MCP1665T-E/MRA; created_on: 23/03/2022 9:51:43 PM; parttype: PMIC - Voltage Regulators - DC DC Switching Regulators; rohs: 1; updated_on: 28/03/2022 9:26:58 PM; x_current: Not Applicable; x_inductance: Not Applicable; x_Link_URL: https://ww1.microchip.com/downloads/en/DeviceDoc/20005872A.pdf; x_Power: Not Applicable; x_resistance: Not Applicable; x_temp_coef: Not Applicable; x_Tolerance: Not Applicable; x_Vol: Not Applicable
U4 = BD33HC0WEFJ-E2: manufacturer: Rohm Semiconductor; Current: 1A; Maximun Temperature: -25; Minimum Temperature: 85; Power: 3.3W; Voltage: 3.3V; inventory_price: 0.93; partnumber: BD33HC0WEFJ-E2; Manufacturer Part Number: BD33HC0WEFJ-E2; URL Datasheet: https://fscdn.rohm.com/en/products/databook/datasheet/ic/power/linear_regulator/bdxxhc0wefj-e.pdf; Digikey PN: BD33HC0WEFJ-E2CT-ND; parttype: PMIC - Voltage Regulators - Linear

## Sheet AC_Relay.SchDoc
size A4; SheetNumber: 2; SheetTotal: 13
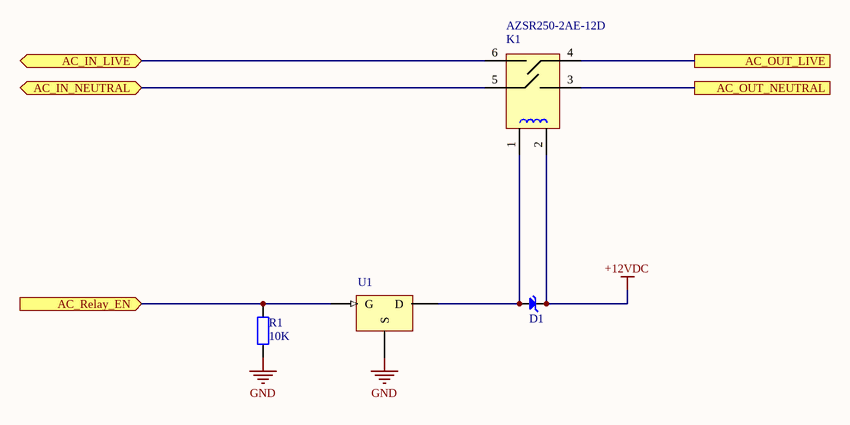
[diagram p5: AC_Relay.SchDoc]

### Parts
D1  SMF16A  [SOD-123H]  (value not drawn)
K1  AZSR250-2AE-12D  [AZSR250]
R1  10K  [RES 0603/1608]
U1  SZNUD3112LT1G  [SZNUD3112LT1G]  (value not drawn)

### Ports
AC_IN_LIVE (bidir), AC_IN_NEUTRAL (bidir), AC_OUT_LIVE, AC_OUT_NEUTRAL, AC_Relay_EN (in)

### Nets
+12VDC: D1.K K1.2
GND: R1.1 U1.2(S)
ISOGND: K1.3 ; port AC_OUT_NEUTRAL
AC_LIVE_IN: K1.6 ; port AC_IN_LIVE
AC_NEUTRAL_IN: K1.5 ; port AC_IN_NEUTRAL
Pump_In: K1.4 ; port AC_OUT_LIVE
NetD1_A: D1.A K1.1 U1.3(D)
NetR1_2: R1.2 U1.1(G) ; port AC_Relay_EN

### Library data of the parts
D1 = SMF16A: as D6 on sheet Gate_Driver; partnumber: SMF16A; Manufacturer Part Number: SMF16A; URL Datasheet: https://www.littelfuse.com/~/media/electronics/datasheets/tvs_diodes/littelfuse_tvs_diode_smf_datasheet.pdf.pdf; parttype: TVS - Diodes
K1 = AZSR250-2AE-12D: manufacturer: American Zettler; inventory_price: 20.25; partnumber: AZSR250-2AE-12D; Manufacturer Part Number: AZSR250-2AE-12D; URL Datasheet: https://www.azettler.com/pdfs/azsr250.pdf; Digikey PN: 2487-AZSR250-2AE-12D-ND; parttype: Power Relays, Over 2 Amps
R1 = RC0603FR-0710KL: as R22 on sheet Gate_Driver; Part Number: RC0603FR-0710KL; Value: 10K; Tolerance: ±1%; Digi-Key Part Number: 311-10.0KHRCT-ND
U1 = SZNUD3112LT1GOSCT-ND: as U10 on sheet PV_Relay; partnumber: SZNUD3112LT1GOSCT-ND; Manufacturer Part Number: SZNUD3112LT1GOSCT-ND; URL Datasheet: https://www.onsemi.com/pdf/datasheet/nud3112-d.pdf; parttype: PMIC - Power Distribution Switches, Load Drivers

## Sheet Analog.SchDoc
size A4; SheetNumber: 3; SheetTotal: 13
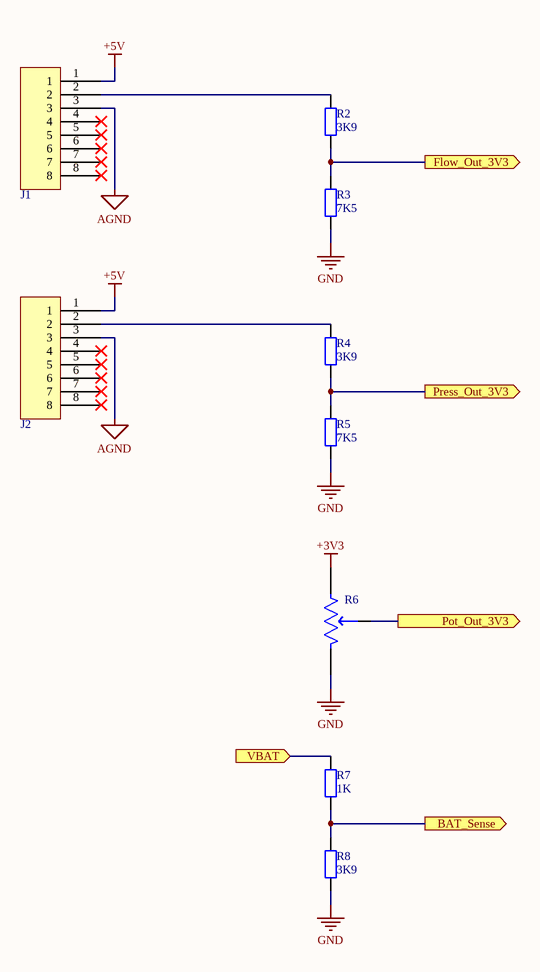
[diagram p6: Analog.SchDoc]

### Parts
J1  MTJ-885X1  [MTJ-885X1]  (value not drawn)
J2  MTJ-885X1  [MTJ-885X1]  (value not drawn)
R2  3K9  [RES 0603/1608]
R3  7K5  [RES 0603/1608]
R4  3K9  [RES 0603/1608]
R5  7K5  [RES 0603/1608]
R6  PDB12-H4301-103BF  [PDB12-H4301-103BF]  (value not drawn)
R7  1K  [RES 0603/1608]
R8  3K9  [RES 0603/1608]

### Ports
BAT_Sense (out), Flow_Out_3V3 (out), Pot_Out_3V3 (out), Press_Out_3V3 (out), VBAT (in)

### Nets
+3V3: R6.1  [project net VDD]
+5V: J1.1 J2.1
AGND: J1.3 J2.3
GND: R3.1 R5.1 R6.3 R8.1
VBAT: R7.2 ; port VBAT
NetJ1_2: J1.2 R2.2
NetJ2_2: J2.2 R4.2
NetR2_1: R2.1 R3.2 ; port Flow_Out_3V3
NetR4_1: R4.1 R5.2 ; port Press_Out_3V3
NetR6_2: R6.2 ; port Pot_Out_3V3
NetR7_1: R7.1 R8.2 ; port BAT_Sense

Not connected (* = marked no-connect by the designer): J1 4* 5* 6* 7* 8*; J2 4* 5* 6* 7* 8*

### Library data of the parts
J1 J2 = MTJ-885X1: as J3 on sheet Farm_Pump; partnumber: MTJ-885X1; Manufacturer Part Number: MTJ-885X1; URL Datasheet: https://app.adam-tech.com/products/download/data_sheet/203809/mtj-885x1-data-sheet.pdf; Digikey PN: 2057-MTJ-885X1-ND; parttype: Modular Connectors - Jacks
R2 R4 R8 = RC0603FR-073K9L: RES SMD 3.9K OHM 1% 1/10W 0603; Manufacturer: Yageo; Package Imperial: 0603; Package Metric: 1608; Temperature Coefficient: ±100ppm/°C; Power (Watts): 0.1W, 1/10W; Part Number: RC0603FR-073K9L; Value: 3K9; Tolerance: ±1%; Digi-Key Part Number: 311-3.90KHRCT-ND
R3 R5 = RC0603FR-077K5L: RES SMD 7.5K OHM 1% 1/10W 0603; Manufacturer: Yageo; Package Imperial: 0603; Package Metric: 1608; Temperature Coefficient: ±100ppm/°C; Power (Watts): 0.1W, 1/10W; Part Number: RC0603FR-077K5L; Value: 7K5; Tolerance: ±1%; Digi-Key Part Number: 311-7.50KHRCT-ND
R6 = PDB12-H4301-103BF: Variable Resistor Symbol; manufacturer: Bourns Inc.; inventory_price: 1.49; partnumber: PDB12-H4301-103BF; Manufacturer Part Number: PDB12-H4301-103BF; URL Datasheet: https://www.bourns.com/docs/Product-Datasheets/PDB12.pdf; Digikey PN: PDB12-H4301-103BF-ND; parttype: Rotary Potentiometers, Rheostats
R7 = RC0603FR-071KL: as R12 on sheet Batt_Charge; Part Number: RC0603FR-071KL; Value: 1K; Tolerance: ±1%; Digi-Key Part Number: 311-1.00KHRCT-ND

## Sheet Voltage_Current_Sense.SchDoc
size A4; SheetNumber: 10; SheetTotal: 13
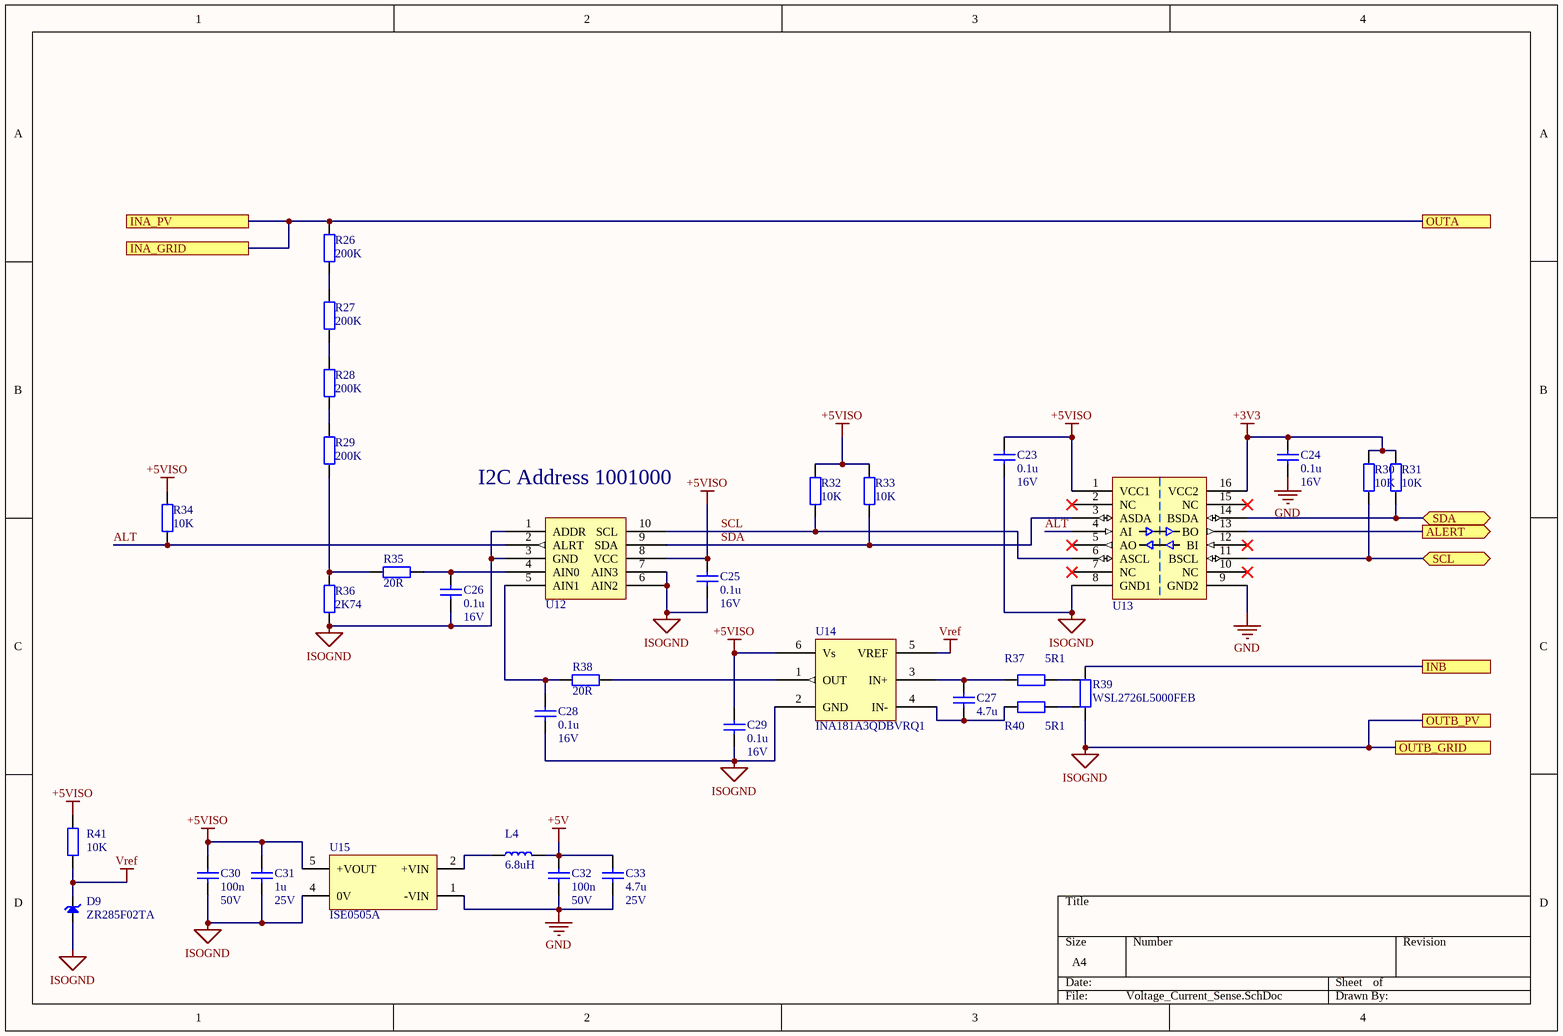
[diagram p7: Voltage_Current_Sense.SchDoc]

### Parts
C23  0.1u  Voltage - Rated: 16V  [CAP 0603/1608]
C24  0.1u  Voltage - Rated: 16V  [CAP 0603/1608]
C25  0.1u  Voltage - Rated: 16V  [CAP 0603/1608]
C26  0.1u  Voltage - Rated: 16V  [CAP 0603/1608]
C27  4.7u  [CAP 0805/2012 - 1.4MM]
C28  0.1u  Voltage - Rated: 16V  [CAP 0603/1608]
C29  0.1u  Voltage - Rated: 16V  [CAP 0603/1608]
C30  100n  Voltage - Rated: 50V  [CAP 0603/1608]
C31  1u  Voltage - Rated: 25V  [CAP 0603/1608]
C32  100n  Voltage - Rated: 50V  [CAP 0603/1608]
C33  4.7u  Voltage - Rated: 25V  [CAP 0603/1608]
D9  ZR285F02TA  [ZR285F02TA]
L4  6.8uH  [1210L]
R26  200K  [RES 1206/3216]
R27  200K  [RES 1206/3216]
R28  200K  [RES 1206/3216]
R29  200K  [RES 1206/3216]
R30  10K  [RES 0603/1608]
R31  10K  [RES 0603/1608]
R32  10K  [RES 0603/1608]
R33  10K  [RES 0603/1608]
R34  10K  [RES 0603/1608]
R35  20R  [RES 0603/1608]
R36  2K74  [RES 1206/3216]
R37  5R1  [RES 0603/1608]
R38  20R  [RES 0603/1608]
R39  WSL2726L5000FEB  [WSL2726L5000FEB]
R40  5R1  [RES 0603/1608]
R41  10K  [RES 0603/1608]
U12  ADS1015IDGSR  [ADS1015IDGSR]  (value not drawn)
U13  SI8605AC-B-IS1R  [SI8605AC-B-IS1R]  (value not drawn)
U14  INA181A3QDBVRQ1  [INA181A3QDBVRQ1]
U15  ISE0505A  [XP ISE 8-SMD]

### Ports
ALERT (out), INA_GRID, INA_PV, INB, OUTA, OUTB_GRID, OUTB_PV, SCL (bidir), SDA (bidir)

### Nets
+3V3: C24.2 R30.2 R31.2 U13.16(VCC2)  [project net VDD]
+5V: C32.1 C33.2 L4.1
+5VISO: C23.2 C25.2 C29.2 C30.2 C31.2 R32.2 R33.2 R34.2 R41.2 U12.8(VCC) U13.1(VCC1) U14.6(Vs) U15.5(+VOUT)
GND: C24.1 C32.2 C33.1 U13.9(GND2) U15.1(-VIN)
ISOGND: C23.1 C25.1 C26.1 C28.2 C29.1 C30.1 C31.1 D9.A R36.1 R39.1 U12.1(ADDR) U12.3(GND) U12.6(AIN2) U12.7(AIN3) U13.8(GND1) U14.2(GND) U15.4(0V) ; port OUTB_PV, port OUTB_GRID
Vref: D9.K R41.1 U14.5(VREF)
Alert: U13.13(BO) ; port ALERT
ALT: R34.1 U12.2(ALRT) U13.4(AI)
I2C_SCL: R30.1 U13.11(BSCL) ; port SCL
I2C_SDA: R31.1 U13.14(BSDA) ; port SDA
Pump_In: R26.2 ; port INA_PV, port OUTA, port INA_GRID
Return: R39.2 ; port INB
SCL: R32.1 U12.10(SCL) U13.6(ASCL)
SDA: R33.1 U12.9(SDA) U13.3(ASDA)
NetC26_2: C26.2 R35.2 U12.4(AIN0)
NetC27_1: C27.1 R40.1 U14.4(IN-)
NetC27_2: C27.2 R37.1 U14.3(IN+)
NetC28_1: C28.1 R38.2 U12.5(AIN1)
NetL4_2: L4.2 U15.2(+VIN)
NetR26_1: R26.1 R27.2
NetR27_1: R27.1 R28.2
NetR28_1: R28.1 R29.2
NetR29_1: R29.1 R35.1 R36.2
NetR37_2: R37.2 R39.4
NetR38_1: R38.1 U14.1(OUT)
NetR39_3: R39.3 R40.2

Not connected (* = marked no-connect by the designer): U13 2(NC)* 5(AO)* 7(NC)* 10(NC)* 12(BI)* 15(NC)*

### Notes on the sheet
- (near U12) I2C Address 1001000

### Library data of the parts
C23-C26 C28 C29 = GRM188R71C104KA01D: CAP CER 0.1UF 16V X7R 0603; Manufacturer: Murata Electronics North America; Package Imperial: 0603; Package Metric: 1608; Tolerance: 0.1; Value: 0.1u; Part Number: GRM188R71C104KA01D; Dielectric: X7R; Digi-Key Part Number: 490-1532-6-ND
C27 = C0805C475K9RACTU: CAP CER 4.7UF 6.3V X7R 0805; Manufacturer: KEMET; Package Imperial: 0805; Package Metric: 2012; Tolerance: 0.1; Value: 4.7u; Voltage - Rated: 6.3V; Part Number: C0805C475K9RACTU; Dielectric: X7R; Digi-Key Part Number: 399-7417-1-ND
C30 C32 = GCM188R71H104KA57D: as C11 on sheet DC_Volt_Sense; Value: 100n; Part Number: GCM188R71H104KA57D; Digi-Key Part Number: 490-4779-1-ND
C31 = CL10B105KA8NNNC: as C12 on sheet DC_Volt_Sense; Value: 1u; Part Number: CL10B105KA8NNNC; Dielectric: X7R; Digi-Key Part Number: 1276-1184-1-ND
C33 = GRM188C81E475KE11D: as C14 on sheet DC_Volt_Sense; Value: 4.7u; Part Number: GRM188C81E475KE11D; Dielectric: X6S; Digi-Key Part Number: 490-7199-1-ND
D9 = ZR285F02TA: Zener Diode; manufacturer: Diodes Incorporated; inventory_price: 1.51; partnumber: ZR285F02TA; Manufacturer Part Number: ZR285F02TA; URL Datasheet: https://www.diodes.com/assets/Datasheets/ZR285.pdf; Digikey PN: ZR285F02CT-ND; parttype: PMIC - Voltage Reference
L4 = TFM322512ALMA6R8MTAA: as L2 on sheet DC_Volt_Sense; Digi-Key Part Number: 445-16384-1-ND; partnumber: TFM322512ALMA6R8MTAA; Manufacturer Part Number: TDK Corporation; URL Datasheet: https://product.tdk.com/info/en/catalog/datasheets/inductor_automotive_power_tfm322512alma_en.pdf?ref_disty=digikey; Digikey PN: 445-TFM322512ALMA6R8MTAACT-ND; parttype: Fixed Inductor
R26-R29 = RC1206FR-07200KL: as R13 on sheet DC_Volt_Sense; Part Number: RC1206FR-07200KL; Value: 200K; Tolerance: ±1%; Digi-Key Part Number: 311-200KFRCT-ND
R30-R34 R41 = RC0603FR-0710KL: as R22 on sheet Gate_Driver; Part Number: RC0603FR-0710KL; Value: 10K; Tolerance: ±1%; Digi-Key Part Number: 311-10.0KHRCT-ND
R35 R38 = RC0603FR-0720RL: RES SMD 20 OHM 1% 1/10W 0603; Manufacturer: Yageo; Package Imperial: 0603; Package Metric: 1608; Temperature Coefficient: ±100ppm/°C; Power (Watts): 0.1W, 1/10W; Part Number: RC0603FR-0720RL; Value: 20R; Tolerance: ±1%; Digi-Key Part Number: 311-20.0HRCT-ND
R36 = RC1206FR-072K74L: as R17 on sheet DC_Volt_Sense; Part Number: RC1206FR-072K74L; Value: 2K74; Tolerance: ±1%; Digi-Key Part Number: 311-2.74KFRCT-ND
R37 R40 = RC0603FR-075R1L: RES SMD 5.1 OHM 1% 1/10W 0603; Manufacturer: Yageo; Package Imperial: 0603; Package Metric: 1608; Temperature Coefficient: ±200ppm/°C; Power (Watts): 0.1W, 1/10W; Part Number: RC0603FR-075R1L; Value: 5R1; Tolerance: ±1%; Digi-Key Part Number: YAG3372CT-ND
R39 = WSL2726L5000FEB: Resistor Symbol; manufacturer: Vishay Dale; inventory_price: 3.82; partnumber: WSL2726L5000FEB; Manufacturer Part Number: WSL2726L5000FEB; URL Datasheet: https://www.vishay.com/docs/30131/wsl2726.pdf; Digikey PN: WSLQ-.0005CT-ND; parttype: Chip Resistor - Surface Mount
U12 = ADS1015IDGSR: IC ADC 12BIT SIGMA-DELTA 10VSSOP; Manufacturer: Texas Instruments; inventory_price: 4.47; ComponentLink1Description: Datasheet; Mount: SMT; Supplier 1: Digi-Key; Manufacturer Part Number: ADS1015IDGSR; Supplier Part Number 1: 296-41185-1-ND; partnumber: ADS1015IDGSR; URL Datasheet: https://www.ti.com/general/docs/suppproductinfo.tsp?distId=10&gotoUrl=https%3A%2F%2Fwww.ti.com%2Flit%2Fgpn%2Fads1013; Digikey PN: 296-41185-1-ND; parttype: Data Acquisition - Analog to Digital Converters (ADC)
U13 = SI8605AC-B-IS1R: DGT ISOL 3750VRMS 4CH I2C 16SOIC; Manufacturer: Skyworks Solutions Inc.; inventory_price: 11.35; Manufacturer Part Number: SI8605AC-B-IS1R; ComponentLink1Description: Datasheet; Mount: SMT; Supplier 1: Digi-Key; Supplier Part Number 1: Silicon Labs; partnumber: SI8605AC-B-IS1R; URL Datasheet: https://www.skyworksinc.com/-/media/Skyworks/SL/documents/public/data-sheets/Si860x.pdf; Digikey PN: 336-4927-1-ND; parttype: Digital Isolators
U14 = INA181A3QDBVRQ1: manufacturer: Texas Instraments; inventory_price: 0.94; partnumber: INA181A3QDBVRQ1; Manufacturer Part Number: INA181A3QDBVRQ1; URL Datasheet: https://www.ti.com/general/docs/suppproductinfo.tsp?distId=10&gotoUrl=https%3A%2F%2Fwww.ti.com%2Flit%2Fgpn%2Fina181-q1; Digikey PN: 296-INA181A3QDBVRQ1CT-ND; parttype: Linear - Amplifiers - Instrumentation, OP Amps, Buffer Amps
U15 = ISE0505A: as U5 on sheet DC_Volt_Sense; Part Number: ISE0505A; Digi-Key Part Number: 1470-2945-1-ND

## Sheet DCDC.SchDoc
size A4; SheetNumber: 5; SheetTotal: 13
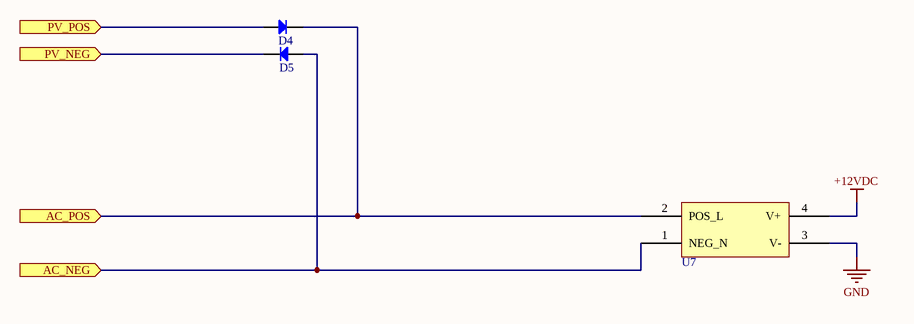
[diagram p8: DCDC.SchDoc]

### Parts
D4  S3G-13-F  [SMC DO-214AB]  (value not drawn)
D5  S3G-13-F  [SMC DO-214AB]  (value not drawn)
U7  EPS-25-12  [EPS-25-12]  (value not drawn)

### Ports
AC_NEG (in), AC_POS (in), PV_NEG (in), PV_POS (in)

### Nets
+12VDC: U7.4(V+)
DC_NEG_OUT: D5.K ; port PV_NEG
GND: U7.3(V-)
AC_LIVE_IN: D4.K U7.2(POS_L) ; port AC_POS
AC_NEUTRAL_IN: D5.A U7.1(NEG_N) ; port AC_NEG
DC_POS_IN: D4.A ; port PV_POS

### Library data of the parts
D4 D5 = 1047-0014: DIODE GEN PURP 400V 3A SMC; Manufacturer: Diodes Incorporated; Current: A; Voltage: V; id: 459057; inventory_price: 0.4; x_Capacitance: Not Applicable; x_Link_Description: Datasheet; x_port_to_unleashed: No; Supplier 1: Digi-Key; Supplier Part Number 1: CUS10S30H3FTR-ND; Manufacturer Part Number: S3G-13-F; Mount: SMT; ComponentLink1URL: https://toshiba.semicon-storage.com/info/docget.jsp?did=14077&prodName=CUS10S30; ComponentLink1Description: Datasheet; partnumber: 1047-0014; created_on: 21/02/2022 8:49:25 PM; parttype: Diodes - Rectifiers - Single; rohs: 1; updated_on: 21/02/2022 9:00:39 PM; x_current: Not Applicable; x_inductance: Not Applicable; x_Link_URL: https://www.diodes.com/assets/Datasheets/ds16005.pdf; x_max_temp: N/A; x_min_temp: N/A; x_Power: Not Applicable; x_resistance: Not Applicable; x_temp_coef: Not Applicable; x_Tolerance: Not Applicable; x_Vol: Not Applicable
U7 = 1092-0010: AC/DC CONVERTER 12V 25W; manufacturer: MEAN WELL USA Inc.; id: 467390; inventory_price: 15.52; x_Capacitance: Not Applicable; x_Link_Description: Datasheet; x_max_temp: 70°C (With Derating); x_min_temp: -30°C; x_port_to_unleashed: No; partnumber: 1092-0010; Manufacturer Part Number: EPS-25-12; created_on: 22/04/2022 3:43:51 PM; parttype: AC DC Converters; rohs: 1; updated_on: 22/04/2022 4:03:59 PM; x_current: Not Applicable; x_inductance: Not Applicable; x_Link_URL: https://www.meanwellusa.com/upload/pdf/EPS-25/EPS-25-spec.pdf; x_Power: 25W; x_resistance: Not Applicable; x_temp_coef: Not Applicable; x_Tolerance: Not Applicable; x_Vol: Not Applicable

## Sheet LED.SchDoc
size A4; SheetNumber: 13; SheetTotal: 13
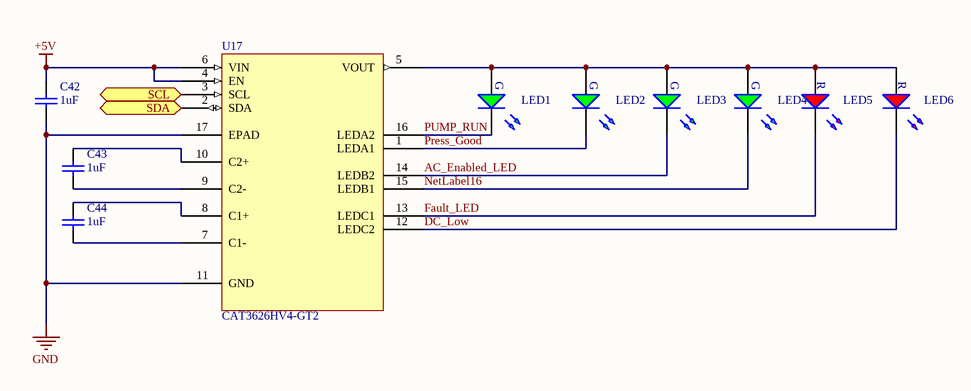
[diagram p9: LED.SchDoc]

### Parts
C42  1uF  [0603C]
C43  1uF  [0603C]
C44  1uF  [0603C]
LED1  LED-G  [0805D]  (value not drawn)
LED2  LED-G  [0805D]  (value not drawn)
LED3  LED-G  [0805D]  (value not drawn)
LED4  LED-G  [0805D]  (value not drawn)
LED5  LED-R  [0805D]  (value not drawn)
LED6  LED-R  [0805D]  (value not drawn)
U17  CAT3626HV4-GT2  [CAT3626HV4-GT2]

### Ports
SCL (bidir), SDA (bidir)

### Nets
+5V: C42.2 U17.4(EN) U17.6(VIN)
GND: C42.1 U17.11(GND) U17.17(EPAD)
AC_Enabled_LED: LED3.2(G_K) U17.14(LEDB2)
DC_Low: LED6.2(R_K) U17.12(LEDC2)
Fault_LED: LED5.2(R_K) U17.13(LEDC1)
I2C_SCL: U17.3(SCL) ; port SCL
I2C_SDA: U17.2(SDA) ; port SDA
NetLabel16: LED4.2(G_K) U17.15(LEDB1)
Press_Good: LED2.2(G_K) U17.1(LEDA1)
PUMP_RUN: LED1.2(G_K) U17.16(LEDA2)
NetC43_1: C43.1 U17.9(C2-)
NetC43_2: C43.2 U17.10(C2+)
NetC44_1: C44.1 U17.7(C1-)
NetC44_2: C44.2 U17.8(C1+)
NetLED1_1: LED1.1(G_A) LED2.1(G_A) LED3.1(G_A) LED4.1(G_A) LED5.1(R_A) LED6.1(R_A) U17.5(VOUT)

### Notes on the sheet
- (in symbol 1001-0001) G
- (in symbol 1001-0002) R

### Library data of the parts
C42-C44 = 1000-0007: CAP CER 1UF 25V X5R 0603; Manufacturer: Samsung Electro-Mechanics; Manufacturer Part Number: CL10A105KA8NNNC; id: 376116; inventory_price: 0.01253; x_Capacitance: 1µF; x_Link_Description: Datasheet; x_max_temp: 85°C; x_min_temp: -55°C; x_Tolerance: ±10%; partnumber: 1000-0007; created_on: 4/03/2020 7:09:07 PM; parttype: Ceramic Capacitors; rohs: -1; updated_on: 23/08/2021 6:14:35 PM; x_Link_URL: http://www.samsungsem.com/kr/support/product-search/mlcc/CL10A105KA8NNNC.jsp
LED1-LED4 = 1001-0001: LED GREEN CLEAR 0805 SMD; Manufacturer Part Number: 150080GS75000; Manufacturer: Würth Elektronik; Current: A; Voltage: V; id: 376117; inventory_price: 0.18; x_Capacitance: Not Applicable; x_Link_Description: Datasheet; x_port_to_unleashed: No; Supplier 1: Digikey; Supplier Part Number 1: 1642-1508-1-ND; Mount: SMT; ComponentLink1Description: Datasheet; partnumber: 1001-0001; created_on: 4/03/2020 7:22:47 PM; parttype: LED Indication - Discrete; rohs: 1; updated_on: 12/04/2022 11:43:19 AM; x_current: Not Applicable; x_inductance: Not Applicable; x_Link_URL: https://www.we-online.com/katalog/datasheet/150080GS75000.pdf; x_max_temp: N/A; x_min_temp: N/A; x_Power: Not Applicable; x_resistance: Not Applicable; x_temp_coef: Not Applicable; x_Tolerance: Not Applicable; x_Vol: Not Applicable
LED5 LED6 = 1001-0002: LED RED CLEAR 0805 SMD; Manufacturer Part Number: 150080RS75000; Manufacturer: Würth Elektronik; Current: A; Voltage: V; id: 376134; inventory_price: 0.18; x_Capacitance: Not Applicable; x_Link_Description: Datasheet; x_port_to_unleashed: No; Supplier 1: Digikey; Supplier Part Number 1: 1642-1508-1-ND; Mount: SMT; ComponentLink1Description: Datasheet; partnumber: 1001-0002; created_on: 4/03/2020 10:57:11 PM; parttype: LED Indication - Discrete; rohs: 1; updated_on: 12/04/2022 11:43:19 AM; x_current: Not Applicable; x_inductance: Not Applicable; x_Link_URL: https://www.we-online.com/katalog/datasheet/150080RS75000.pdf; x_max_temp: N/A; x_min_temp: N/A; x_Power: Not Applicable; x_resistance: Not Applicable; x_temp_coef: Not Applicable; x_Tolerance: Not Applicable; x_Vol: Not Applicable
U17 = CAT3626HV4-GT2: Mfr_Name: onsemi; inventory_price: 2.5; Copyright: Copyright (C) 2022 Ultra Librarian. All rights reserved.; Manufacturer_Part_Number: CAT3626HV4-GT2; Digi-Key_Part_Number_1: 2156-CAT3626HV4-GT2-ND; Digi-Key_Part_Number_2: 2156-CAT3626HV4-GT2-OS-ND; Digi-Key_Part_Number_3: CAT3626HV4-GT2OSCT-ND; Digi-Key_Part_Number_4: CAT3626HV4-GT2OSDKR-ND; Digi-Key_Part_Number_5: CAT3626HV4-GT2OSTR-ND; RefDes: RefDes; Type: DEV; partnumber: CAT3626HV4-GT2; Manufacturer Part Number: CAT3626HV4-GT2; URL Datasheet: https://www.onsemi.com/pdf/datasheet/cat3626-d.pdf; Digikey PN: CAT3626HV4-GT2OSCT-ND; manufacturer: Onsemi; parttype: PMIC - LED Drivers

## Sheet LoRa_Module.SchDoc
size A4; SheetNumber: 7; SheetTotal: 13
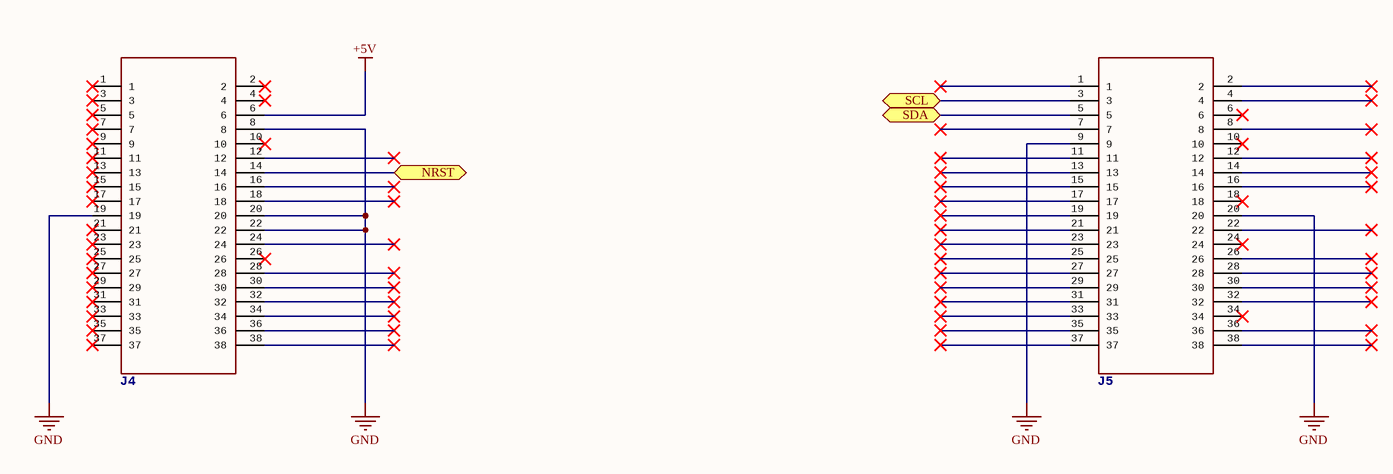
[diagram p10: LoRa_Module.SchDoc]

### Parts
J4  SSW-119-01-F-D  [SSW-119-01-F-D]  (value not drawn)
J5  SSW-119-01-F-D  [SSW-119-01-F-D]  (value not drawn)

### Ports
NRST (bidir), SCL (bidir), SDA (bidir)

### Nets
+5V: J4.6
GND: J4.8 J4.19 J4.20 J4.22 J5.9 J5.20
I2C_SCL: J5.3 ; port SCL
I2C_SDA: J5.5 ; port SDA
NRST: J4.14 ; port NRST

Not connected (* = marked no-connect by the designer): J4 1* 2* 3* 4* 5* 7* 9* 10* 11* 12* 13* 15* 16* 17* 18* 21* 23* 24* 25* 26* 27* 28* 29* 30* 31* 32* 33* 34* 35* 36* 37* 38*; J5 1* 2* 4* 6* 7* 8* 10* 11* 12* 13* 14* 15* 16* 17* 18* 19* 21* 22* 23* 24* 25* 26* 27* 28* 29* 30* 31* 32* 33* 34* 35* 36* 37* 38*

### Library data of the parts
J4 J5 = 1095-0013: CONN RCPT 38POS 0.1 GOLD PCB; manufacturer: Samtec Inc.; id: 461832; inventory_price: 6.48; x_Capacitance: Not Applicable; x_current: 5.7A per Contact; x_max_temp: 125°C; x_min_temp: -55°C; x_port_to_unleashed: No; partnumber: 1095-0013; Manufacturer Part Number: SSW-119-01-F-D; created_on: 29/03/2022 9:34:22 PM; parttype: Rectangular Connectors - Headers, Receptacles, Female Sockets; rohs: 1; updated_on: 29/03/2022 9:39:06 PM; x_inductance: Not Applicable; x_Power: Not Applicable; x_resistance: Not Applicable; x_temp_coef: Not Applicable; x_Tolerance: Not Applicable; x_Vol: Not Applicable

## Sheet MainController.SchDoc
size A4; SheetNumber: 11; SheetTotal: 13
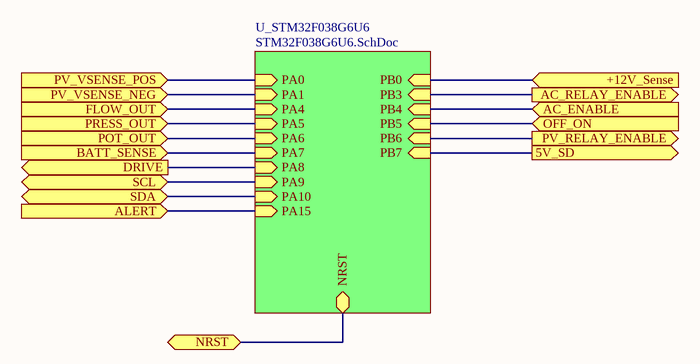
[diagram p11: MainController.SchDoc]

### Sub-sheets
U_STM32F038G6U6 = STM32F038G6U6.SchDoc: NRST (bidir), PB0 (in), PB3 (in), PB4 (in), PB5 (in), PB6 (in), PB7 (in), PA0 (in), PA1 (in), PA4 (in), PA5 (in), PA6 (in), PA7 (in), PA8 (in), PA9 (in), PA10 (in), PA15 (in)

### Ports
5V_SD (out), +12V_Sense (in), AC_ENABLE (in), AC_RELAY_ENABLE (out), ALERT (in), BATT_SENSE (in), DRIVE (out), FLOW_OUT (in), NRST (bidir), OFF_ON (in), POT_OUT (in), PRESS_OUT (in), PV_RELAY_ENABLE (out), PV_VSENSE_NEG (in), PV_VSENSE_POS (in), SCL (bidir), SDA (bidir)

### Nets
AC_Enabled: port AC_ENABLE, sheet U_STM32F038G6U6/PB4
Alert: port ALERT, sheet U_STM32F038G6U6/PA15
HV_SENSE_NEG: port PV_VSENSE_NEG, sheet U_STM32F038G6U6/PA1
HV_SENSE_POS: port PV_VSENSE_POS, sheet U_STM32F038G6U6/PA0
I2C_SCL: port SCL, sheet U_STM32F038G6U6/PA9
I2C_SDA: port SDA, sheet U_STM32F038G6U6/PA10
NRST: port NRST, sheet U_STM32F038G6U6/NRST
ON_OFF: port OFF_ON, sheet U_STM32F038G6U6/PB5
NetR1_2: port AC_RELAY_ENABLE, sheet U_STM32F038G6U6/PB3
NetR2_1: port FLOW_OUT, sheet U_STM32F038G6U6/PA4
NetR4_1: port PRESS_OUT, sheet U_STM32F038G6U6/PA5
NetR6_2: port POT_OUT, sheet U_STM32F038G6U6/PA6
NetR7_1: port BATT_SENSE, sheet U_STM32F038G6U6/PA7
NetR20_1: port DRIVE, sheet U_STM32F038G6U6/PA8
NetR24_2: port PV_RELAY_ENABLE, sheet U_STM32F038G6U6/PB6
NetR?#1_1: port +12V_Sense, sheet U_STM32F038G6U6/PB0
NetU3_7: port 5V_SD, sheet U_STM32F038G6U6/PB7